# EAGLE design GBM16-4A (EAGLE 5.07)
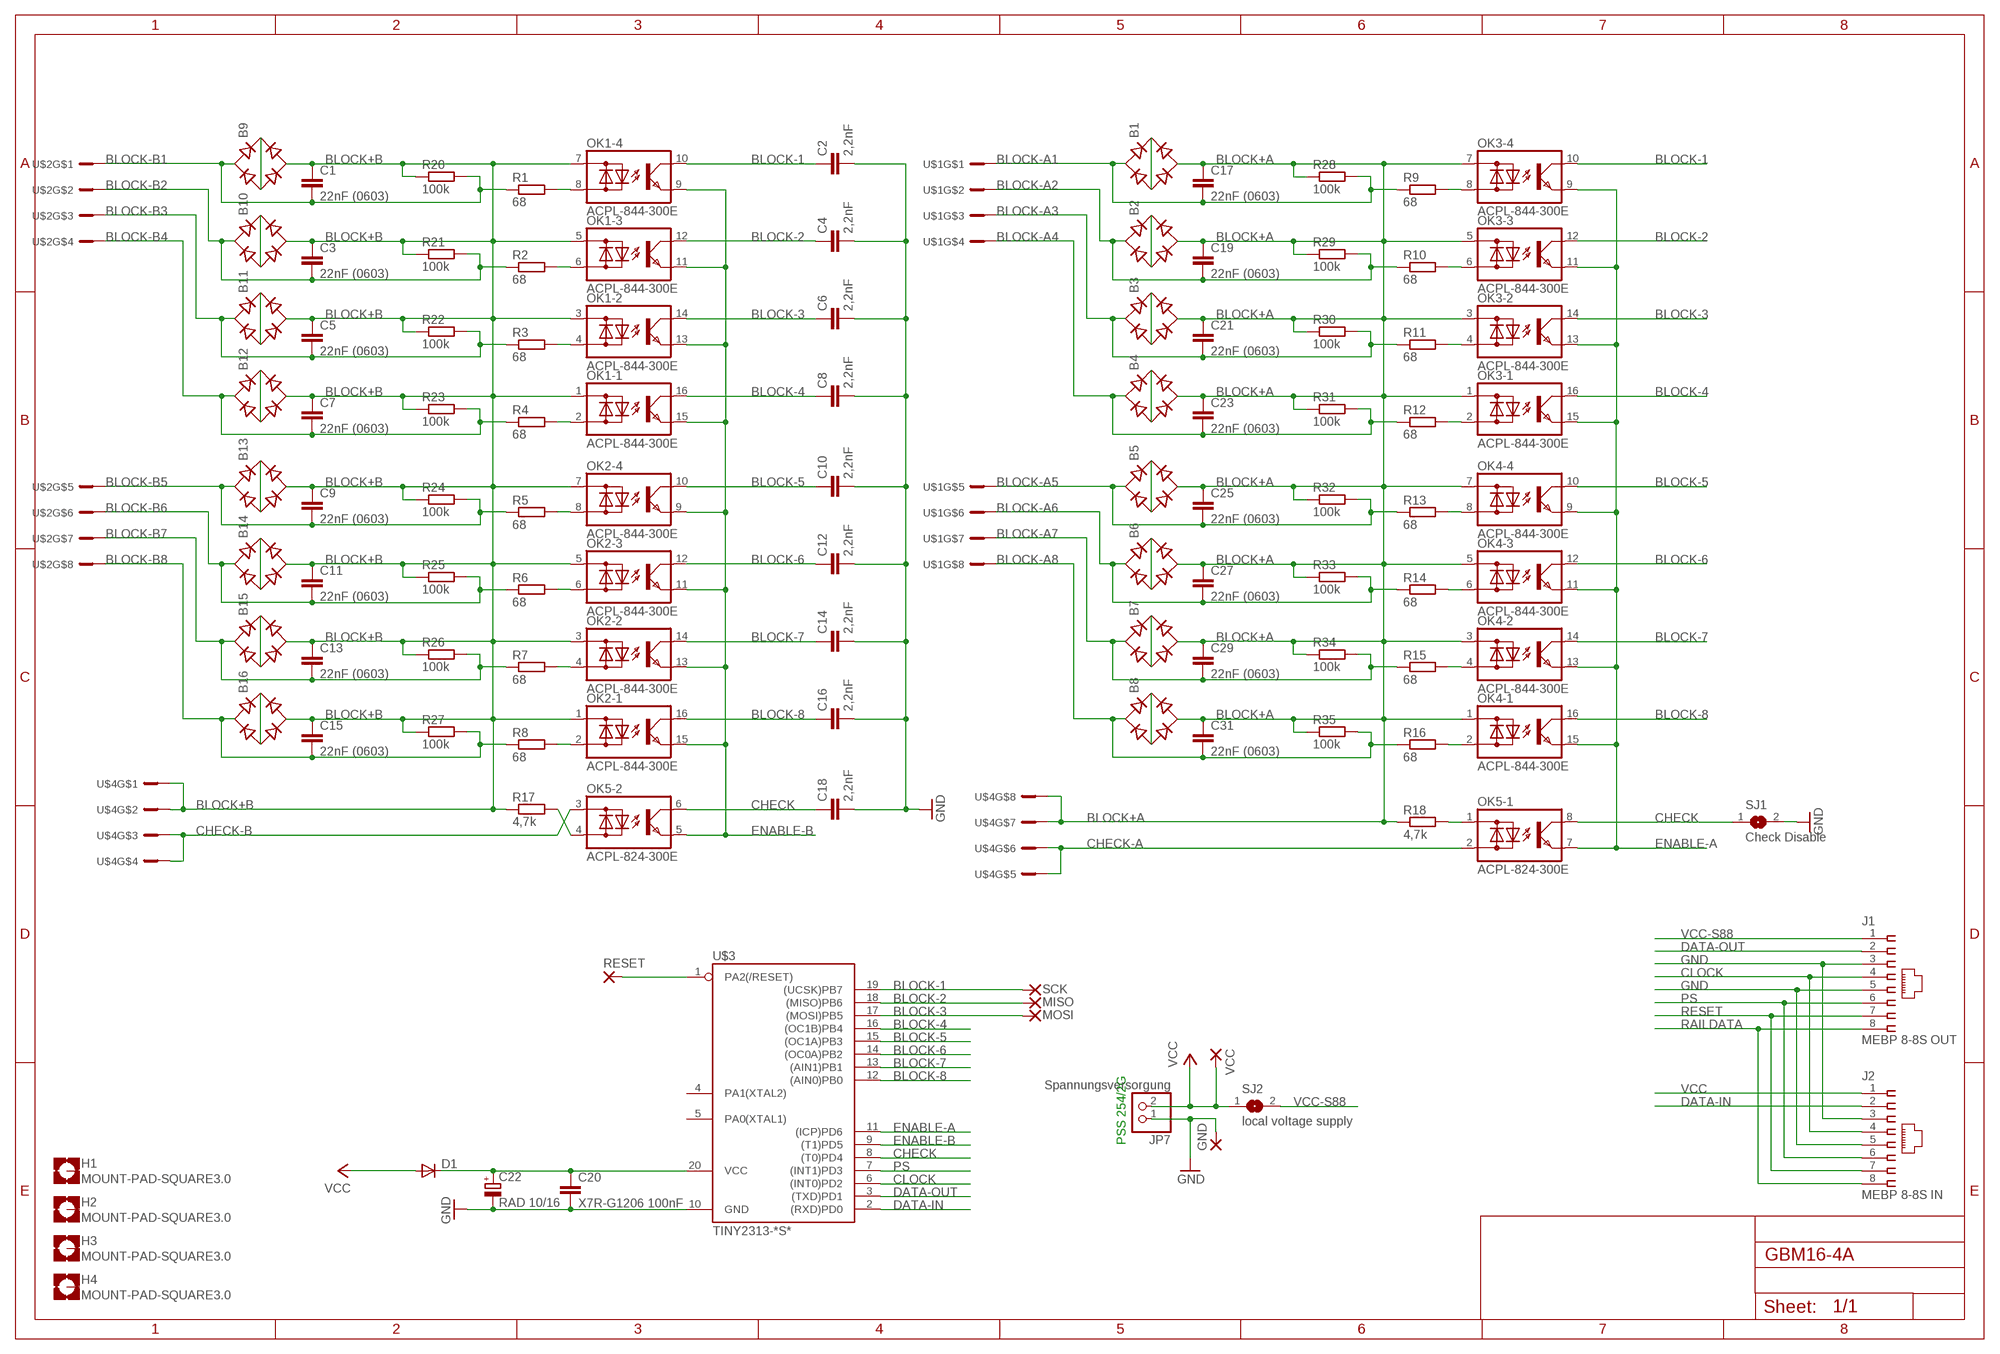
[diagram p0: schematic, sheet 1]

## Parts
B1  GBU4S  [GBU4S]
B2  GBU4S  [GBU4S]
B3  GBU4S  [GBU4S]
B4  GBU4S  [GBU4S]
B5  GBU4S  [GBU4S]
B6  GBU4S  [GBU4S]
B7  GBU4S  [GBU4S]
B8  GBU4S  [GBU4S]
B9  GBU4S  [GBU4S]
B10  GBU4S  [GBU4S]
B11  GBU4S  [GBU4S]
B12  GBU4S  [GBU4S]
B13  GBU4S  [GBU4S]
B14  GBU4S  [GBU4S]
B15  GBU4S  [GBU4S]
B16  GBU4S  [GBU4S]
C1  22nF (0603)  C-EUC0603  [C0603]
C2  2,2nF  C-EUC1206  [C1206]
C3  22nF (0603)  C-EUC0603  [C0603]
C4  2,2nF  C-EUC1206  [C1206]
C5  22nF (0603)  C-EUC0603  [C0603]
C6  2,2nF  C-EUC1206  [C1206]
C7  22nF (0603)  C-EUC0603  [C0603]
C8  2,2nF  C-EUC1206  [C1206]
C9  22nF (0603)  C-EUC0603  [C0603]
C10  2,2nF  C-EUC1206  [C1206]
C11  22nF (0603)  C-EUC0603  [C0603]
C12  2,2nF  C-EUC1206  [C1206]
C13  22nF (0603)  C-EUC0603  [C0603]
C14  2,2nF  C-EUC1206  [C1206]
C15  22nF (0603)  C-EUC0603  [C0603]
C16  2,2nF  C-EUC1206  [C1206]
C17  22nF (0603)  C-EUC0603  [C0603]
C18  2,2nF  C-EUC1206  [C1206]
C19  22nF (0603)  C-EUC0603  [C0603]
C20  X7R-G1206 100nF  C-EUC1206  [C1206]
C21  22nF (0603)  C-EUC0603  [C0603]
C22  RAD 10/16  CPOL-EUE2.5-6  [E2,5-6]
C23  22nF (0603)  C-EUC0603  [C0603]
C25  22nF (0603)  C-EUC0603  [C0603]
C27  22nF (0603)  C-EUC0603  [C0603]
C29  22nF (0603)  C-EUC0603  [C0603]
C31  22nF (0603)  C-EUC0603  [C0603]
D1  DIODE-MINIMELF  [MINIMELF]
GND  SMD2  [SMD1,27-2,54]
H1  MOUNT-PAD-SQUARE3.0  [3,0-PAD-SQUARE]
H2  MOUNT-PAD-SQUARE3.0  [3,0-PAD-SQUARE]
H3  MOUNT-PAD-SQUARE3.0  [3,0-PAD-SQUARE]
H4  MOUNT-PAD-SQUARE3.0  [3,0-PAD-SQUARE]
J1  MEBP 8-8S OUT  555162-1  [555162-1]
J2  MEBP 8-8S IN  555162-1  [555162-1]
JP7  Spannungsversorgung  PINHD-1X2  [1X02]
MISO  SMD2  [SMD1,27-2,54]
MOSI  SMD2  [SMD1,27-2,54]
OK1  ACPL-844-300E  [DIP16]
OK2  ACPL-844-300E  [DIP16]
OK3  ACPL-844-300E  [DIP16]
OK4  ACPL-844-300E  [DIP16]
OK5  ACPL-824-300E  [DIP8]
R1  68  R-EU_R1206  [R1206]
R2  68  R-EU_R1206  [R1206]
R3  68  R-EU_R1206  [R1206]
R4  68  R-EU_R1206  [R1206]
R5  68  R-EU_R1206  [R1206]
R6  68  R-EU_R1206  [R1206]
R7  68  R-EU_R1206  [R1206]
R8  68  R-EU_R1206  [R1206]
R9  68  R-EU_R1206  [R1206]
R10  68  R-EU_R1206  [R1206]
R11  68  R-EU_R1206  [R1206]
R12  68  R-EU_R1206  [R1206]
R13  68  R-EU_R1206  [R1206]
R14  68  R-EU_R1206  [R1206]
R15  68  R-EU_R1206  [R1206]
R16  68  R-EU_R1206  [R1206]
R17  4,7k  R-EU_R1206  [R1206]
R18  4,7k  R-EU_R1206  [R1206]
R20  100k  R-EU_R0603  [R0603]
R21  100k  R-EU_R0603  [R0603]
R22  100k  R-EU_R0603  [R0603]
R23  100k  R-EU_R0603  [R0603]
R24  100k  R-EU_R0603  [R0603]
R25  100k  R-EU_R0603  [R0603]
R26  100k  R-EU_R0603  [R0603]
R27  100k  R-EU_R0603  [R0603]
R28  100k  R-EU_R0603  [R0603]
R29  100k  R-EU_R0603  [R0603]
R30  100k  R-EU_R0603  [R0603]
R31  100k  R-EU_R0603  [R0603]
R32  100k  R-EU_R0603  [R0603]
R33  100k  R-EU_R0603  [R0603]
R34  100k  R-EU_R0603  [R0603]
R35  100k  R-EU_R0603  [R0603]
RESET  SMD2  [SMD1,27-2,54]
SCK  SMD2  [SMD1,27-2,54]
SJ1  Check Disable  SJ  [SJ]
SJ2  local voltage supply  SJ  [SJ]
U$1  AST021-08  [P_AST021-08]
U$2  AST021-08  [P_AST021-08]
U$3  TINY2313-*S*  [SO20L$]
U$4  AST021-08  [P_AST021-08]
VCC  SMD2  [SMD1,27-2,54]

## Nets
BLOCK+A: B1.AC2 B2.AC2 B3.AC2 B4.AC2 B5.AC2 B6.AC2 B7.AC2 B8.AC2 C17.1 C19.1 C21.1 C23.1 C25.1 C27.1 C29.1 C31.1 OK3.1(-1:AC1) OK3.3(-2:AC1) OK3.5(-3:AC1) OK3.7(-4:AC1) OK4.1(-1:AC1) OK4.3(-2:AC1) OK4.5(-3:AC1) OK4.7(-4:AC1) R18.1 R28.1 R29.1 R30.1 R31.1 R32.1 R33.1 R34.1 R35.1 U$4.P$7 U$4.P$8
BLOCK+B: B9.AC2 B10.AC2 B11.AC2 B12.AC2 B13.AC2 B14.AC2 B15.AC2 B16.AC2 C1.1 C3.1 C5.1 C7.1 C9.1 C11.1 C13.1 C15.1 OK1.1(-1:AC1) OK1.3(-2:AC1) OK1.5(-3:AC1) OK1.7(-4:AC1) OK2.1(-1:AC1) OK2.3(-2:AC1) OK2.5(-3:AC1) OK2.7(-4:AC1) R17.1 R20.1 R21.1 R22.1 R23.1 R24.1 R25.1 R26.1 R27.1 U$4.P$1 U$4.P$2
BLOCK-1: C2.1 OK1.10(-4:C) OK3.10(-4:C) SCK.1(P) U$3.19((UCSK)PB7)
BLOCK-2: C4.1 MISO.1(P) OK1.12(-3:C) OK3.12(-3:C) U$3.18((MISO)PB6)
BLOCK-3: C6.1 MOSI.1(P) OK1.14(-2:C) OK3.14(-2:C) U$3.17((MOSI)PB5)
BLOCK-4: C8.1 OK1.16(-1:C) OK3.16(-1:C) U$3.16((OC1B)PB4)
BLOCK-5: C10.1 OK2.10(-4:C) OK4.10(-4:C) U$3.15((OC1A)PB3)
BLOCK-6: C12.1 OK2.12(-3:C) OK4.12(-3:C) U$3.14((OC0A)PB2)
BLOCK-7: C14.1 OK2.14(-2:C) OK4.14(-2:C) U$3.13((AIN1)PB1)
BLOCK-8: C16.1 OK2.16(-1:C) OK4.16(-1:C) U$3.12((AIN0)PB0)
BLOCK-A1: B1.AC1 C17.2 R9.1 R28.2 U$1.P$1
BLOCK-A2: B2.AC1 C19.2 R10.1 R29.2 U$1.P$2
BLOCK-A3: B3.AC1 C21.2 R11.1 R30.2 U$1.P$3
BLOCK-A4: B4.AC1 C23.2 R12.1 R31.2 U$1.P$4
BLOCK-A5: B5.AC1 C25.2 R13.1 R32.2 U$1.P$5
BLOCK-A6: B6.AC1 C27.2 R14.1 R33.2 U$1.P$6
BLOCK-A7: B7.AC1 C29.2 R15.1 R34.2 U$1.P$7
BLOCK-A8: B8.AC1 C31.2 R16.1 R35.2 U$1.P$8
BLOCK-B1: B9.AC1 C1.2 R1.1 R20.2 U$2.P$1
BLOCK-B2: B10.AC1 C3.2 R2.1 R21.2 U$2.P$2
BLOCK-B3: B11.AC1 C5.2 R3.1 R22.2 U$2.P$3
BLOCK-B4: B12.AC1 C7.2 R4.1 R23.2 U$2.P$4
BLOCK-B5: B13.AC1 C9.2 R5.1 R24.2 U$2.P$5
BLOCK-B6: B14.AC1 C11.2 R6.1 R25.2 U$2.P$6
BLOCK-B7: B15.AC1 C13.2 R7.1 R26.2 U$2.P$7
BLOCK-B8: B16.AC1 C15.2 R8.1 R27.2 U$2.P$8
CHECK: C18.1 OK5.6(-2:C) OK5.8(-1:C) SJ1.1 U$3.8((T0)PD4)
CHECK-A: OK5.2(-1:AC2) U$4.P$5 U$4.P$6
CHECK-B: OK5.3(-2:AC1) U$4.P$3 U$4.P$4
CLOCK: J1.4 J2.4 U$3.6((INT0)PD2)
DATA-IN: J2.2 U$3.2((RXD)PD0)
DATA-OUT: J1.2 U$3.3((TXD)PD1)
ENABLE-A: OK3.9(-4:E) OK3.11(-3:E) OK3.13(-2:E) OK3.15(-1:E) OK4.9(-4:E) OK4.11(-3:E) OK4.13(-2:E) OK4.15(-1:E) OK5.7(-1:E) U$3.11((ICP)PD6)
ENABLE-B: OK1.9(-4:E) OK1.11(-3:E) OK1.13(-2:E) OK1.15(-1:E) OK2.9(-4:E) OK2.11(-3:E) OK2.13(-2:E) OK2.15(-1:E) OK5.5(-2:E) U$3.9((T1)PD5)
GND: C2.2 C4.2 C6.2 C8.2 C10.2 C12.2 C14.2 C16.2 C18.2 C20.2 C22.- GND.1(P) J1.3 J1.5 J2.3 J2.5 JP7.1 SJ1.2 U$3.10(GND)
N$1: B9.+ B9.-
N$3: OK1.8(-4:AC2) R1.2
N$4: OK5.4(-2:AC2) R17.2
N$7: OK5.1(-1:AC1) R18.2
N$8: C20.1 C22.+ D1.C U$3.20(VCC)
N$10: B10.+ B10.-
N$11: OK2.6(-3:AC2) R6.2
N$13: OK1.6(-3:AC2) R2.2
N$14: OK2.4(-2:AC2) R7.2
N$15: B11.+ B11.-
N$16: OK1.4(-2:AC2) R3.2
N$17: OK2.8(-4:AC2) R5.2
N$18: OK1.2(-1:AC2) R4.2
N$19: B12.+ B12.-
N$20: OK2.2(-1:AC2) R8.2
N$21: OK3.8(-4:AC2) R9.2
N$23: OK3.6(-3:AC2) R10.2
N$24: B13.+ B13.-
N$25: RESET.1(P) U$3.1(PA2(/RESET))
N$26: OK3.4(-2:AC2) R11.2
N$27: B14.+ B14.-
N$29: OK4.6(-3:AC2) R14.2
N$32: OK3.2(-1:AC2) R12.2
N$35: B15.+ B15.-
N$36: OK4.4(-2:AC2) R15.2
N$39: B16.+ B16.-
N$41: OK4.8(-4:AC2) R13.2
N$42: OK4.2(-1:AC2) R16.2
N$44: B1.+ B1.-
N$47: B2.+ B2.-
N$55: B3.+ B3.-
N$59: B4.+ B4.-
N$65: B5.+ B5.-
N$68: B6.+ B6.-
N$76: B7.+ B7.-
N$80: B8.+ B8.-
PS: J1.6 J2.6 U$3.7((INT1)PD3)
RAILDATA: J1.8 J2.8
RESET: J1.7 J2.7
VCC: D1.A J2.1 JP7.2 SJ2.1 VCC.1(P)
VCC-S88: J1.1 SJ2.2
Unconnected: H1.B3,0(MOUNT) H2.B3,0(MOUNT) H3.B3,0(MOUNT) H4.B3,0(MOUNT) U$3.4(PA1(XTAL2)) U$3.5(PA0(XTAL1))

## Notes on the sheet
- PSS 254/2G

## Library data of the parts
B1-B16 = rectifier:GBU4S: GENERAL INSTRUMENT RECTIFIER
C1-C21 C23 C25 C27 C29 C31 = rcl:C-EU: CAPACITOR, European symbol
C22 = rcl:CPOL-EU: POLARIZED CAPACITOR, European symbol
D1 = diode:DIODE-: DIODE
GND MISO MOSI RESET SCK VCC = wirepad:SMD2: SMD PAD
H1-H4 = holes:MOUNT-PAD-SQUARE: MOUNTING PAD, square
J1 J2 = con-amp:555162-1: AMP connector
JP7 = pinhead:PINHD-1X2: PIN HEADER
OK1-OK4 = my-optocoupler:ACPL-844-300E: FOTOTRANSISTOR/OPTOKOPPLER ACPL-844-300E Conrad Artikel-Nr.: 140222 - 62
OK5 = my-optocoupler:ACPL-824-300E: FOTOTRANSISTOR/OPTOKOPPLER ACPL-824-300E Conrad Artikel-Nr.: 140220 - 62
R1-R18 R20-R35 = rcl:R-EU_: RESISTOR, European symbol
SJ1 SJ2 = jumper:SJ: SMD solder JUMPER
U$1 U$2 U$4 = con-ria-ast027-750:AST021-08
U$3 = avr-6:TINY2313*: Atmel Tiny2313 2K Flash, 128 bytes EEPROM, 128 bytes RAM

## Board
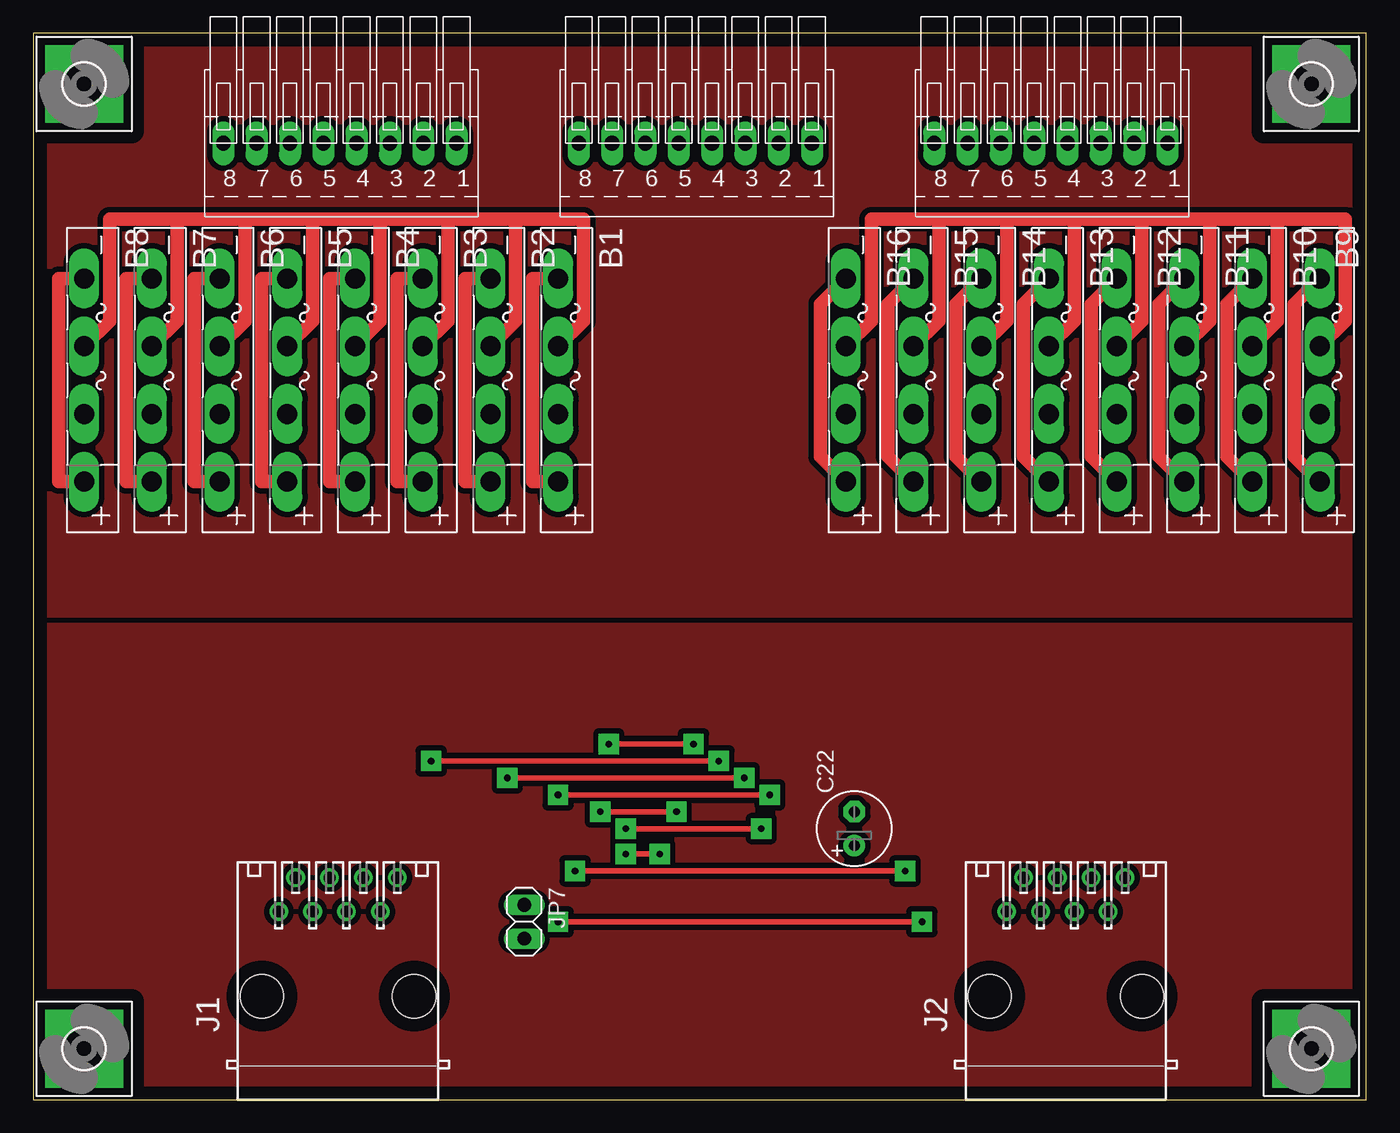
[diagram p1: board, top side]
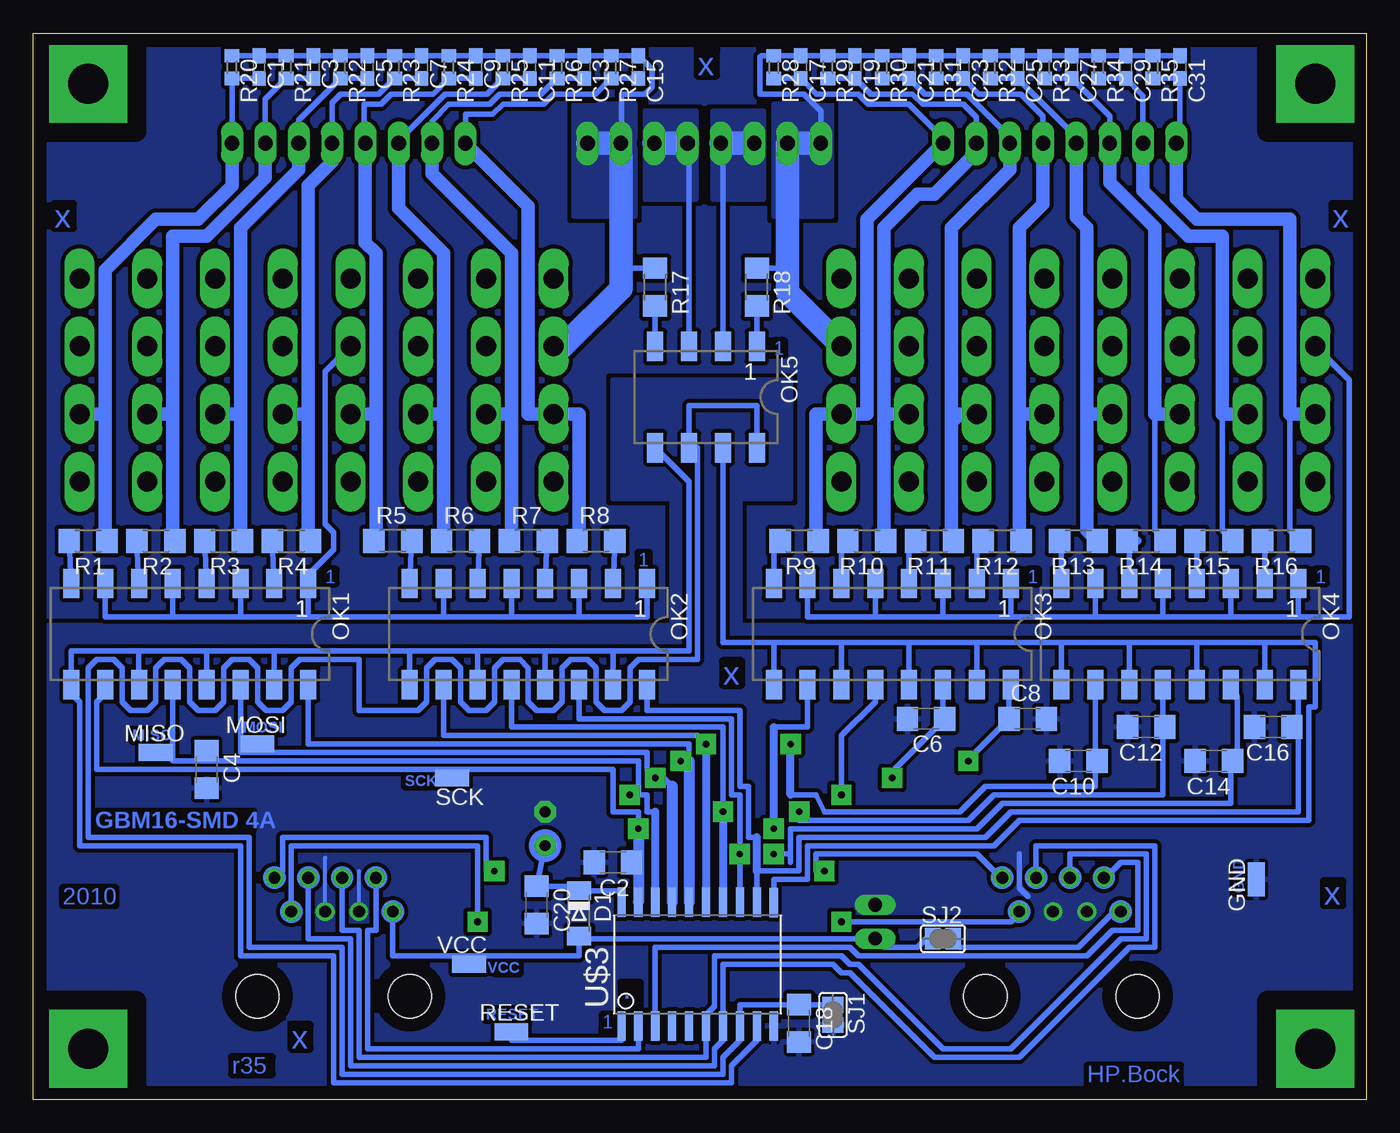
[diagram p2: board, bottom side, seen from below]

Size 100 x 80 mm. Coordinates in mm from the lower left corner, seen from the top.
Outline: 0,0 100,0 100,80 0,80 0,0
Copper layers (1*16): Top 0.035mm / dielectric 1.5mm / Bottom 0.035mm
Design rules "default": minimum track width 10mil, minimum drill 24mil, track to track 8mil, track to pad 8mil, pad to pad 8mil, via to via 8mil, smd to smd 8mil, copper to edge 40mil, drill to drill 8mil, minimum pad ring 10mil, minimum via ring 8mil, stop-mask expansion 4mil, vias tented up to drill 0mil, thermal gap 10mil

### Footprints (pad centres in the part's own frame; a part is rotated, then mirrored left to right if it is on the bottom)
GBU4S = drill 1.499 long: + 7.62,0; - -7.62,0; AC1 2.54,0; AC2 -2.54,0
C0603 = smd 1.1 x 1: 1 -0.85,0; 2 0.85,0
C1206 = smd 1.6 x 1.8: 1 -1.4,0; 2 1.4,0
E2,5-6 = drill 0.813 pad 1.6 round: + -1.27,0 | drill 0.813 pad 1.6 octagon: - 1.27,0
MINIMELF = smd 1.4 x 1.8: A 1.7,0; C -1.7,0
SMD1,27-2,54 = smd 1.27 x 2.54: 1 0,0
3,0-PAD-SQUARE = drill 3 pad 5.842 square: B3,0 0,0
555162-1 = drill 0.889 round: 1 -4.445,5.207; 2 -3.175,7.747; 3 -1.905,5.207; 4 -0.635,7.747; 5 0.635,5.207; 6 1.905,7.747; 7 3.175,5.207; 8 4.445,7.747 | hole 3.251: -5.715,-1.143; 5.715,-1.143
1X02 = drill 1.016 long: 1 -1.27,0; 2 1.27,0
DIP16 = smd 1.2 x 2.2: 1 -8.89,-3.8; 2 -6.35,-3.8; 3 -3.81,-3.8; 4 -1.27,-3.8; 5 1.27,-3.8; 6 3.81,-3.8; 7 6.35,-3.8; 8 8.89,-3.8; 9 8.89,3.8; 10 6.35,3.8; 11 3.81,3.8; 12 1.27,3.8; 13 -1.27,3.8; 14 -3.81,3.8; 15 -6.35,3.8; 16 -8.89,3.8
DIP8 = smd 1.2 x 2.2: 1 -3.81,-3.8; 2 -1.27,-3.8; 3 1.27,-3.8; 4 3.81,-3.8; 5 3.81,3.8; 6 1.27,3.8; 7 -1.27,3.8; 8 -3.81,3.8
R1206 = smd 1.6 x 1.803: 1 -1.422,0; 2 1.422,0
R0603 = smd 1 x 1.1: 1 -0.85,0; 2 0.85,0
SJ = smd 1.168 x 1.6: 1 -0.762,0; 2 0.762,0
P_AST021-08 = drill 1.1 long: P$1 0,0; P$2 2.5,0; P$3 5,0; P$4 7.5,0; P$5 10,0; P$6 12.5,0; P$7 15,0; P$8 17.5,0
SO20L$ = smd 0.61 x 2.21: 1 -5.715,-4.636; 2 -4.445,-4.636; 3 -3.175,-4.636; 4 -1.905,-4.636; 5 -0.635,-4.636; 6 0.635,-4.636; 7 1.905,-4.636; 8 3.175,-4.636; 9 4.445,-4.636; 10 5.715,-4.636; 11 5.715,4.61; 12 4.445,4.636; 13 3.175,4.636; 14 1.905,4.636; 15 0.635,4.636; 16 -0.635,4.636; 17 -1.905,4.636; 18 -3.175,4.636; 19 -4.445,4.636; 20 -5.715,4.636

### Placement (x,y rotation side)
B1  39.37,53.98 270 top
B2  34.29,53.98 270 top
B3  29.21,53.98 270 top
B4  24.13,53.98 270 top
B5  19.05,53.98 270 top
B6  13.97,53.98 270 top
B7  8.89,53.98 270 top
B8  3.81,53.98 270 top
B9  96.52,53.98 270 top
B10  91.44,53.98 270 top
B11  86.36,53.98 270 top
B12  81.28,53.98 270 top
B13  76.2,53.98 270 top
B14  71.12,53.98 270 top
B15  66.04,53.98 270 top
B16  60.96,53.98 270 top
C1  83.06,77.47 270 bottom
C2  56.52,17.78 180 bottom
C3  78.99,77.47 270 bottom
C4  87,24.77 270 bottom
C5  74.93,77.47 270 bottom
C6  33.02,28.57 180 bottom
C7  70.87,77.47 270 bottom
C8  25.4,28.57 0 bottom
C9  66.8,77.47 270 bottom
C10  21.59,25.4 180 bottom
C11  62.74,77.47 270 bottom
C12  16.51,27.94 180 bottom
C13  58.67,77.47 270 bottom
C14  11.43,25.4 180 bottom
C15  54.61,77.47 270 bottom
C16  6.99,27.94 180 bottom
C17  42.42,77.47 270 bottom
C18  42.55,5.71 270 bottom
C19  38.35,77.47 270 bottom
C20  62.23,14.61 270 bottom
C21  34.29,77.47 270 bottom
C22  61.59,20.32 90 top
C23  30.23,77.47 270 bottom
C25  26.16,77.47 270 bottom
C27  22.1,77.47 270 bottom
C29  18.03,77.47 270 bottom
C31  13.97,77.47 270 bottom
D1  59.05,13.97 270 bottom
GND  8.26,16.51 0 bottom
H1  3.81,76.2 0 top
H2  95.89,76.2 0 top
H3  3.81,3.81 0 top
H4  95.89,3.81 0 top
J1  22.86,8.89 0 top
J2  77.47,8.89 0 top
JP7  36.83,13.34 270 top
MISO  90.81,26.04 270 bottom
MOSI  83.19,26.67 270 bottom
OK1  88.27,34.92 180 bottom
OK2  62.87,34.92 180 bottom
OK3  35.56,34.92 180 bottom
OK4  13.97,34.92 180 bottom
OK5  49.53,52.7 180 bottom
R1  95.89,41.91 180 bottom
R2  90.81,41.91 180 bottom
R3  85.72,41.91 180 bottom
R4  80.64,41.91 180 bottom
R5  73.03,41.91 0 bottom
R6  67.94,41.91 0 bottom
R7  62.87,41.91 0 bottom
R8  57.78,41.91 0 bottom
R9  42.55,41.91 180 bottom
R10  37.47,41.91 180 bottom
R11  32.38,41.91 180 bottom
R12  27.3,41.91 180 bottom
R13  21.59,41.91 180 bottom
R14  16.51,41.91 180 bottom
R15  11.43,41.91 180 bottom
R16  6.35,41.91 180 bottom
R17  53.34,60.96 270 bottom
R18  45.72,60.96 270 bottom
R20  85.09,77.47 270 bottom
R21  81.03,77.47 270 bottom
R22  76.96,77.47 270 bottom
R23  72.9,77.47 270 bottom
R24  68.83,77.47 270 bottom
R25  64.77,77.47 270 bottom
R26  60.71,77.47 270 bottom
R27  56.64,77.47 270 bottom
R28  44.45,77.47 270 bottom
R29  40.39,77.47 270 bottom
R30  36.32,77.47 270 bottom
R31  32.26,77.47 270 bottom
R32  28.19,77.47 270 bottom
R33  24.13,77.47 270 bottom
R34  20.07,77.47 270 bottom
R35  16,77.47 270 bottom
RESET  64.14,5.08 270 bottom
SCK  68.58,24.13 90 bottom
SJ1  40.01,6.35 270 bottom
SJ2  31.75,12.06 0 bottom
U$1  31.75,71.75 180 top
U$2  85.09,71.75 180 top
U$3  50.16,10.16 0 bottom
U$4  58.42,71.75 180 top
VCC  67.31,10.16 270 bottom

### Tracks (layer width: path | path; a pad name or v marks a point on that pad's centre or on a via)
BLOCK+A
  Top 1.016: B8.AC2 5.71,58.42 5.71,66.04 10.79,66.04 | 10.79,66.04 15.88,66.04 | 15.88,66.04 20.95,66.04 | 20.95,66.04 26.04,66.04 | 26.04,66.04 31.11,66.04 | 31.11,66.04 36.2,66.04 | 36.2,66.04 41.27,66.04 41.27,58.42 B1.AC2 | B7.AC2 10.79,58.42 10.79,66.04 | B6.AC2 15.88,58.42 15.88,66.04 | B5.AC2 20.95,58.42 20.95,66.04 | B4.AC2 26.04,58.42 26.04,66.04 | B3.AC2 31.11,58.42 31.11,66.04 | B2.AC2 36.2,58.42 36.2,66.04
  Bottom 0.406: 5.08,36.2 OK4.1 | 5.08,36.2 10.16,36.2 | 10.16,36.2 OK4.3 | 10.16,36.2 15.24,36.2 | 15.24,36.2 OK4.5 | 15.24,36.2 20.32,36.2 | 20.32,36.2 OK4.7 | 20.32,36.2 26.67,36.2 | 26.67,36.2 OK3.1 | 26.67,36.2 31.75,36.2 | 31.75,36.2 OK3.3 | 31.75,36.2 36.83,36.2 | 36.83,36.2 OK3.5 | 36.83,36.2 41.91,36.2 OK3.7 | B8.AC2 1.27,53.98 1.27,36.2 5.08,36.2 | C31.1 R35.1 C29.1 R34.1 C27.1 R33.1 C25.1 R32.1 C23.1 R31.1 C21.1 R30.1 C19.1 R29.1 C17.1 R28.1 45.38,78.32 45.47,78.23 45.47,75.44 42.16,75.44 40.89,74.17 40.89,71.78 U$4.P$8 | 43.42,62.38 R18.1
  Bottom 1.016: 43.42,60.56 43.42,60.96
  Bottom 1.778: U$4.P$8 U$4.P$7 43.42,60.96 43.42,62.38 | B1.AC2 43.42,60.56
  pour Bottom (isolate 0.406, no thermals): 40.13,74.68 40.13,66.29 44.45,66.29 44.45,74.68
BLOCK+B
  Top 1.016: B9.AC2 98.42,58.42 98.42,66.04 93.34,66.04 | 67.94,66.04 62.87,66.04 62.87,58.42 B16.AC2 | 73.03,66.04 67.94,66.04 | 78.11,66.04 73.03,66.04 | 78.11,66.04 83.19,66.04 | 83.19,66.04 88.27,66.04 | 88.27,66.04 93.34,66.04 | B10.AC2 93.34,58.42 93.34,66.04 | B11.AC2 88.27,58.42 88.27,66.04 | B12.AC2 83.19,58.42 83.19,66.04 | B13.AC2 78.11,58.42 78.11,66.04 | B14.AC2 73.03,58.42 73.03,66.04 | B15.AC2 67.94,58.42 67.94,66.04
  Bottom 0.406: OK2.1 53.98,38.1 53.98,36.2 59.05,36.2 | 59.05,36.2 OK2.3 | 59.05,36.2 64.14,36.2 | 64.14,36.2 OK2.5 | 69.22,36.2 OK2.7 | 64.14,36.2 69.22,36.2 | 84.45,36.2 OK1.3 | 69.22,36.2 79.38,36.2 | 79.38,36.2 84.45,36.2 | 89.53,36.2 OK1.5 | 84.45,36.2 89.53,36.2 | OK1.7 94.61,36.2 89.53,36.2 | 79.38,36.2 OK1.1 79.38,39.37 77.47,41.27 77.47,42.55 78.11,43.18 78.11,54.61 B13.AC2 | R20.1 C1.1 R21.1 C3.1 R22.1 C5.1 R23.1 C7.1 R24.1 C9.1 R25.1 C11.1 R26.1 C13.1 R27.1 C15.1 53.59,77.3 53.59,75.95 54.1,75.44 55.88,75.44 55.88,71.88 56.01,71.75 | R17.1 55.77,62.38 55.92,62.23
  Bottom 1.016: B16.AC2 60.25,56.52
  Bottom 1.676: U$4.P$2 U$4.P$1
  Bottom 1.778: U$4.P$2 55.92,62.23 55.92,60.85 60.25,56.52 | U$4.P$1 56.01,71.75
  pour Bottom (isolate 0.406, no thermals): 59.44,74.68 59.44,66.29 54.86,66.29 54.86,74.68
BLOCK-1  (via drill 0.5 pad 1.52)
  Top 0.406: v44.45,20.32 v54.61,20.32
  Bottom 0.406: OK1.10 94.61,30.48 95.25,29.84 95.25,24.77 68.58,24.77 | v54.61,20.32 54.61,21.59 56.52,21.59 56.52,24.77 68.58,24.77 | 44.45,27.94 41.91,27.94 OK3.10 | 54.61,17.78 C2.1 | 68.58,24.77 SCK.1
  Bottom 0.61: v44.45,20.32 44.45,27.94
  Bottom 0.813: v54.61,20.32 54.61,17.78 U$3.19
BLOCK-2  (via drill 0.5 pad 1.52)
  Top 0.406: v39.37,22.86 v55.24,22.86
  Bottom 0.406: 53.34,21.59 53.98,21.59 53.98,22.86 54.61,22.86 | v55.24,22.86 54.61,22.86 | 54.61,22.86 54.61,25.4 86.36,25.4 | 89.53,26.04 89.53,25.4 86.36,25.4 | 89.53,26.04 OK1.12 | 86.36,25.4 C4.1 | 89.53,26.04 MISO.1 | v39.37,22.86 39.37,27.3 36.83,29.84 OK3.12
  Bottom 0.61: 53.34,21.59 U$3.18
BLOCK-3  (via drill 0.5 pad 1.52)
  Top 0.406: v35.56,24.13 v53.34,24.13
  Bottom 0.406: 52.07,23.5 52.7,24.13 v53.34,24.13 53.98,24.77 53.98,26.04 82.55,26.04 | 82.55,26.04 84.45,26.04 OK1.14 | OK3.14 31.75,27.94 31.62,27.94 C6.1 35.56,24.64 v35.56,24.13 | 82.55,26.04 MOSI.1
  Bottom 0.813: 52.07,23.5 U$3.17
BLOCK-4  (via drill 0.5 pad 1.52)
  Top 0.406: v29.84,25.4 v51.44,25.4
  Bottom 0.406: v51.44,25.4 50.8,25.4 50.8,26.67 79.38,26.67 OK1.16 | C8.1 26.67,28.57 | v29.84,25.4 29.98,25.4 C8.1 | C8.1 26.8,31 OK3.16
  Bottom 0.813: 50.8,25.4 U$3.16
BLOCK-5  (via drill 0.5 pad 1.52)
  Top 0.406: v43.18,26.67 v49.53,26.67
  Bottom 0.406: OK2.10 69.22,27.3 50.16,27.3 v49.53,26.67 | 43.18,22.86 41.27,22.86 40.64,21.59 30.48,21.59 28.57,23.5 20.32,23.5 20.32,24.77 | 20.32,24.77 OK4.10 | C10.1 20.19,24.77 20.32,24.77
  Bottom 0.61: v49.53,26.67 U$3.15 | 43.18,22.86 v43.18,26.67
BLOCK-6  (via drill 0.5 pad 1.52)
  Top 0.406: v42.55,21.59 v48.26,21.59
  Bottom 0.406: OK2.12 64.14,27.94 48.26,27.94 v48.26,21.59 | 15.24,27.3 OK4.12 | v42.55,21.59 42.55,20.95 29.84,20.95 27.94,22.86 15.24,22.86 15.24,27.3 | 15.24,27.3 C12.1
  Bottom 0.61: v48.26,21.59 U$3.14
BLOCK-7  (via drill 0.5 pad 1.52)
  Top 0.406: v44.45,18.41 v46.99,18.41
  Bottom 0.406: OK2.14 59.05,28.57 47.62,28.57 47.62,22.86 46.99,22.86 v46.99,18.41 U$3.13 | 10.16,25.4 9.65,25.91 9.65,30.23 10.16,30.73 OK4.14 | 43.18,18.41 43.18,20.32 29.21,20.32 27.3,22.23 10.16,22.23 10.16,25.4 | 43.18,18.41 43.18,17.78 | 43.18,18.41 v44.45,18.41 | 10.16,25.4 C14.1
BLOCK-8
  Bottom 0.406: OK2.16 53.98,29.21 46.99,29.21 46.99,23.5 46.35,23.5 46.35,19.68 45.72,19.68 | U$3.12 45.72,17.14 42.55,17.14 42.55,19.68 28.57,19.68 26.67,21.59 5.08,21.59 OK4.16 5.08,27.94 C16.1
  Bottom 0.61: 45.72,17.14 45.72,19.68
BLOCK-A1
  Bottom 0.406: R28.2 C17.2 41.24,75.44 38.1,75.44 37.34,74.68 34.29,74.68 31.75,72.14 U$1.P$1
  Bottom 1.016: R9.1 41.27,42.39 41.27,51.44 B1.AC1 37.47,51.44 37.47,66.04 U$1.P$1
BLOCK-A2
  Bottom 0.406: R29.2 C19.2 37.17,75.44 34.04,75.44 33.27,74.68 30.23,74.68 29.25,73.7 U$1.P$2
  Bottom 1.016: 36.2,51.44 36.2,65.41 33.66,67.94 32.38,67.94 29.25,71.08 U$1.P$2 | 36.2,51.44 B2.AC1 | 36.2,51.44 36.2,42.39 R10.1
BLOCK-A3
  Bottom 0.406: R30.2 C21.2 33.11,75.44 29.97,75.44 26.75,72.22 U$1.P$3
  Bottom 1.016: 31.11,50.8 31.11,42.39 R11.1 | 31.11,50.8 31.11,65.41 26.75,69.77 U$1.P$3 | B3.AC1 30.48,51.44 31.11,50.8
BLOCK-A4
  Bottom 0.406: R31.2 C23.2 29.04,75.44 25.91,75.44 24.25,73.78 U$1.P$4
  Bottom 1.016: 26.04,51.44 26.04,65.41 24.25,67.19 U$1.P$4 | 26.04,51.44 B4.AC1 | 26.04,51.44 26.04,42.39 R12.1
BLOCK-A5
  Bottom 0.406: R32.2 C25.2 21.75,72.21 U$1.P$5
  Bottom 1.016: 20.95,51.44 20.95,65.41 21.75,66.2 U$1.P$5 | 20.95,51.44 B5.AC1 | 20.95,51.44 20.95,42.7 R13.1
BLOCK-A6
  Bottom 0.406: 15.88,51.44 15.88,42.7 R14.1 | R33.2 C27.2 19.25,73.77 U$1.P$6
  Bottom 1.016: B6.AC1 15.88,51.44 15.88,65.41 19.25,68.78 U$1.P$6
BLOCK-A7
  Bottom 0.406: 10.79,51.44 10.79,42.7 R15.1 | R34.2 C29.2 16.75,75.34 U$1.P$7
  Bottom 1.016: B7.AC1 10.79,51.44 10.79,64.77 13.34,64.77 16.75,68.19 U$1.P$7
BLOCK-A8
  Bottom 0.406: 5.71,51.44 5.71,42.7 R16.1 | R35.2 C31.2 13.97,71.75 U$1.P$8
  Bottom 1.016: B8.AC1 5.71,51.44 5.71,66.04 12.7,66.04 14.25,67.59 U$1.P$8
BLOCK-B1
  Bottom 0.406: U$2.P$1 R20.2 C1.2
  Bottom 1.016: U$2.P$1 85.09,68.58 87.63,66.04 90.81,66.04 94.61,62.23 94.61,51.44 | 94.61,51.44 B9.AC1 | 94.61,51.44 94.61,42.06 R1.1
BLOCK-B2
  Bottom 0.406: C3.2 R21.2 82.59,75.06 U$2.P$2
  Bottom 1.016: U$2.P$2 82.59,69.17 87,64.77 89.53,64.77 89.53,51.44 | 89.53,51.44 B10.AC1 | 89.53,51.44 89.53,42.06 R2.1
BLOCK-B3
  Bottom 0.406: C5.2 R22.2 80.09,73.49 U$2.P$3
  Bottom 1.016: U$2.P$3 80.09,69.77 84.45,65.41 84.45,51.44 | 84.45,51.44 B11.AC1 | 84.45,51.44 84.45,42.06 R3.1
BLOCK-B4
  Bottom 0.406: C7.2 R23.2 74.08,75.44 76.96,75.44 77.59,74.81 U$2.P$4
  Bottom 1.016: U$2.P$4 77.59,70.36 79.38,68.58 79.38,51.44 | 79.38,51.44 B12.AC1 | 79.38,51.44 79.38,42.06 R4.1
BLOCK-B5
  Bottom 0.406: C9.2 R24.2 70.02,75.44 73.15,75.44 73.91,74.68 75.18,74.68 75.18,71.85 U$2.P$5
  Bottom 1.016: U$2.P$5 75.09,64.3 74.3,63.5 74.3,51.44 | 74.3,51.44 B13.AC1 | 74.3,51.44 74.3,42.06 R5.1
BLOCK-B6
  Bottom 0.406: C11.2 R25.2 65.95,75.44 69.09,75.44 72.59,71.94 U$2.P$6
  Bottom 1.016: U$2.P$6 72.59,66.88 69.22,63.5 69.22,51.44 | 69.22,51.44 B14.AC1 | 69.22,51.44 69.22,42.06 R6.1
BLOCK-B7
  Bottom 0.406: C13.2 R26.2 61.89,75.44 65.02,75.44 65.79,74.68 68.83,74.68 70.09,73.42 U$2.P$7
  Bottom 1.016: U$2.P$7 70.09,69.45 64.14,63.5 64.14,51.44 | 64.14,51.44 B15.AC1 | 64.14,51.44 64.14,42.06 R7.1
BLOCK-B8
  Bottom 0.406: C15.2 R27.2 57.82,75.44 60.96,75.44 61.72,74.68 64.77,74.68 65.53,73.91 67.56,73.91 67.56,71.78 U$2.P$8
  Bottom 1.016: R8.1 59.05,42.06 59.05,51.44 B16.AC1 62.87,51.44 62.87,67.03 U$2.P$8
CHECK
  Bottom 0.406: SJ1.1 C18.1 46.99,7.11 U$3.8 46.99,4.45 48.26,3.17 48.26,1.91 76.83,1.91 76.83,11.43 83.82,11.43 83.82,19.68 95.89,19.68 95.89,32.38 95.25,33.02 93.98,33.02 93.34,32.38 93.34,29.84 92.71,29.21 91.44,29.21 90.81,29.84 90.81,32.38 90.17,33.02 88.9,33.02 88.27,32.38 88.27,29.84 87.63,29.21 86.36,29.21 85.72,29.84 85.72,32.38 85.09,33.02 83.82,33.02 83.19,32.38 83.19,29.84 82.55,29.21 81.28,29.21 80.64,29.84 80.64,32.38 80.01,33.02 75.56,33.02 75.56,29.21 71.12,29.21 70.48,29.84 70.48,32.38 69.85,33.02 68.58,33.02 67.94,32.38 67.94,29.84 67.31,29.21 66.04,29.21 65.41,29.84 65.41,32.38 64.77,33.02 63.5,33.02 62.87,32.38 62.87,29.84 62.23,29.21 60.96,29.21 60.33,29.84 60.33,32.38 59.69,33.02 58.42,33.02 57.78,32.38 57.78,29.84 57.15,29.21 55.88,29.21 55.24,29.84 55.24,32.38 54.61,33.02 50.16,33.02 50.16,46.99 50.16,48.91 OK5.6 50.8,52.07 45.72,52.07 OK5.8
CHECK-A
  Bottom 0.406: OK5.2 48.26,71.59 U$4.P$5
  Bottom 1.778: U$4.P$5 U$4.P$6
  pour Bottom (isolate 0.406, rank 2, no thermals): 45.21,74.17 45.21,67.56 49.02,67.56 49.02,74.17
CHECK-B
  Bottom 0.406: U$4.P$3 53.34,71.67 | OK5.3 50.8,71.64 U$4.P$4
  Bottom 1.778: U$4.P$4 U$4.P$3
  pour Bottom (isolate 0.406, rank 2, no thermals): 50.29,74.17 50.29,67.56 54.1,67.56 54.1,74.17
CLOCK
  Bottom 0.406: J2.4 76.83,12.7 75.56,12.7 75.56,3.17 49.53,3.17 U$3.6 49.53,6.35 48.9,6.99 48.9,10.79 39.37,10.79 38.73,10.16 38.1,10.16 31.75,3.81 26.67,3.81 18.41,12.06 16.51,12.06 16.51,18.41 22.23,18.41 J1.4
DATA-IN
  Bottom 0.406: J2.2 74.3,12.7 74.93,12.7 74.93,3.81 54.61,3.81 U$3.2
DATA-OUT
  Bottom 0.406: U$3.3 53.34,11.43 38.73,11.43 38.1,10.79 20.95,10.79 19.05,12.7 17.14,12.7 17.14,17.78 18.41,17.78 19.56,16.64 J1.2
ENABLE-A
  Bottom 0.406: 7.62,34.29 OK4.15 | 7.62,34.29 12.7,34.29 | 12.7,34.29 OK4.13 | 17.78,34.29 OK4.11 | 12.7,34.29 17.78,34.29 | 22.86,34.29 OK4.9 | 17.78,34.29 22.86,34.29 | 22.86,34.29 29.21,34.29 | 29.21,34.29 OK3.15 | 44.45,34.29 OK3.9 | 29.21,34.29 34.29,34.29 | 34.29,34.29 39.37,34.29 | 39.37,34.29 44.45,34.29 | 39.37,34.29 OK3.11 | 34.29,34.29 OK3.13 | 44.45,34.29 48.26,34.29 OK5.7 | 7.62,34.29 3.81,34.29 3.81,29.46 4.32,29.46 4.32,20.95 26.04,20.95 27.94,19.05 41.91,19.05 41.91,16.51 44.45,16.51 U$3.11
ENABLE-B
  Bottom 0.406: 56.52,33.66 OK2.15 | 56.52,33.66 50.8,33.66 50.8,46.37 OK5.5 53.34,48.9 | 61.59,33.66 56.52,33.66 | 66.67,33.66 61.59,33.66 | 71.75,33.66 66.67,33.66 | 81.92,33.66 71.75,33.66 | 87,33.66 81.92,33.66 | 92.08,33.66 87,33.66 | 92.08,33.66 97.16,33.66 OK1.9 97.16,30.48 96.52,29.84 96.52,19.05 84.45,19.05 84.45,10.79 77.47,10.79 77.47,1.27 47.62,1.27 47.62,2.54 45.72,4.45 U$3.9 | 92.08,33.66 OK1.11 | 87,33.66 OK1.13 | 81.92,33.66 OK1.15 | 71.75,33.66 OK2.9 | 66.67,33.66 OK2.11 | 61.59,33.66 OK2.13
GND
  Bottom 0.305: J2.5 78.11,18.16 | J2.3 75.56,17.14
  Bottom 0.406: 26.04,18.41 26.04,15.88 25.4,15.24
  pour Bottom (isolate 0.305, rank 2): 0,0 100.33,0 99.69,35.56 52.07,35.56 52.07,45.09 56.52,45.09 56.52,53.98 43.18,53.98 43.18,45.09 46.99,45.09 46.99,35.56 0,35.56
  pour Bottom (isolate 0.305, no thermals): 14.61,19.68 30.48,19.68 30.48,10.79 14.61,10.79 14.61,11.43
  pour Bottom (isolate 0.305, rank 2, no thermals): 71.75,19.05 82.55,19.05 82.55,12.06 71.75,12.06
  pour Bottom (isolate 0.305, rank 2, no thermals): 34.29,16.51 39.37,16.51 39.37,13.34 34.29,13.34
  pour Bottom (isolate 0.305, rank 2, no thermals): 59.05,23.5 64.14,23.5 64.14,20.32 59.05,20.32
N$1
  Top 1.016: B9.- 94.61,59.69 94.61,48.26 B9.+
N$3
  Bottom 0.406: OK1.8 R1.2
N$4
  Bottom 0.406: OK5.4 R17.2
N$5
  pour Top (isolate 0.406, rank 2): 0,80.01 0,35.56 99.69,35.56 99.69,80.01
N$6
  pour Top (isolate 0.406): 0,0 0,35.56 99.69,35.56 99.69,0
N$7
  Bottom 0.406: OK5.1 R18.2
N$8
  Bottom 0.406: U$3.20 55.88,15.67 D1.C 59.05,16 C20.1 C22.+
N$10
  Top 1.016: B10.+ 89.53,48.26 89.53,59.69 B10.-
N$11
  Bottom 0.406: OK2.6 R6.2
N$13
  Bottom 0.406: OK1.6 R2.2
N$14
  Bottom 0.406: OK2.4 R7.2
N$15
  Top 1.016: B11.+ 84.45,48.26 84.45,59.69 B11.-
N$16
  Bottom 0.406: OK1.4 R3.2
N$17
  Bottom 0.406: OK2.8 R5.2
N$18
  Bottom 0.406: OK1.2 R4.2
N$19
  Top 1.016: B12.+ 79.38,48.26 79.38,59.69 B12.-
N$20
  Bottom 0.406: OK2.2 R8.2
N$21
  Bottom 0.406: R9.2 44.45,41.43 OK3.8
N$22
  pour Bottom (isolate 0.305, rank 6): 0,36.2 99.69,36.2 99.69,80.01 0,80.01
N$23
  Bottom 0.406: R10.2 39.37,41.43 OK3.6
N$24
  Top 1.016: B13.+ 74.3,48.26 74.3,59.69 B13.-
N$25
  Bottom 0.406: RESET.1 64.14,4.45 55.88,4.45 U$3.1
N$26
  Bottom 0.406: R11.2 34.29,41.43 OK3.4
N$27
  Top 1.016: B14.+ 69.22,48.26 69.22,59.69 B14.-
N$29
  Bottom 0.406: R14.2 17.78,41.76 OK4.6
  Bottom 0.61: R14.2 17.14,41.91
N$32
  Bottom 0.406: R12.2 29.21,41.43 OK3.2
N$35
  Top 1.016: B15.+ 64.14,48.26 64.14,59.69 B15.-
N$36
  Bottom 0.406: R15.2 12.7,41.76 OK4.4
N$39
  Top 1.016: B16.+ 59.05,48.26 59.05,59.69 B16.-
N$41
  Bottom 0.406: OK4.8 22.86,41.76
  Bottom 0.61: 22.86,41.76 R13.2
N$42
  Bottom 0.406: OK4.2 7.62,41.76
  Bottom 0.61: 7.62,41.76 R16.2
N$44
  Top 1.016: B1.+ 37.47,46.35 37.47,61.59 B1.-
N$47
  Top 1.016: B2.+ 32.38,46.35 32.38,61.59 B2.-
N$55
  Top 1.016: B3.+ 27.3,46.35 27.3,61.59 B3.-
N$59
  Top 1.016: B4.+ 22.23,46.35 22.23,61.59 B4.-
N$65
  Top 1.016: B5.+ 17.14,46.35 17.14,61.59 B5.-
N$68
  Top 1.016: B6.+ 12.06,46.35 12.06,61.59 B6.-
N$76
  Top 1.016: B7.+ 6.99,46.35 6.99,61.59 B7.-
N$80
  Top 1.016: B8.+ 1.91,46.35 1.91,61.59 B8.-
PS
  Bottom 0.406: J2.6 79.38,12.06 76.2,12.06 76.2,2.54 48.9,2.54 48.9,3.81 48.26,4.45 U$3.7 48.26,10.16 40.01,10.16 39.37,9.53 38.73,9.53 32.38,3.17 26.04,3.17 17.78,11.43 15.88,11.43 15.88,19.05 24.77,19.05 J1.6
RAILDATA  (via drill 0.5 pad 1.52)
  Top 0.406: v40.64,17.14 v65.41,17.14
  Bottom 0.406: J1.8 27.3,16.51 29.21,18.41 41.27,18.41 41.27,17.14 arc-90 v40.64,17.14 | v65.41,17.14 66.04,17.14 66.04,19.68 81.28,19.68 81.28,17.14 81.79,16.64 J2.8
RESET  (via drill 0.5 pad 1.52)
  Top 0.406: v39.37,13.34 v66.67,13.34
  Bottom 0.406: J1.7 26.04,13.97 26.67,13.34 v39.37,13.34 | v66.67,13.34 66.67,19.05 80.64,19.05 J2.7
VCC
  Bottom 0.406: SJ2.1 33.02,12.06 33.66,11.43 36.2,11.43 JP7.2 59.05,12.06 D1.A 59.05,10.79 67.31,10.79 | J2.1 73.03,10.79 67.31,10.79 | 67.31,10.79 VCC.1
VCC-S88
  Bottom 0.406: J1.1 18.54,13.97 19.05,13.97 21.59,11.43 30.48,11.43 30.99,11.94 SJ2.2
(copper drawn outside any net)
  shapes: Bottom circle x13

### Text on the board
Bottom: x | x | x | 1 | 1 | 1 | 1 | 1 | x | MOSI | MISO | SCK | GBM16-SMD 4A | x | GND | 2010 | VCC | · | 1 | RESET | x | HP.Bock | r35